# EAGLE design FlightComputer_DeploymentBoard (EAGLE 9.0.1)
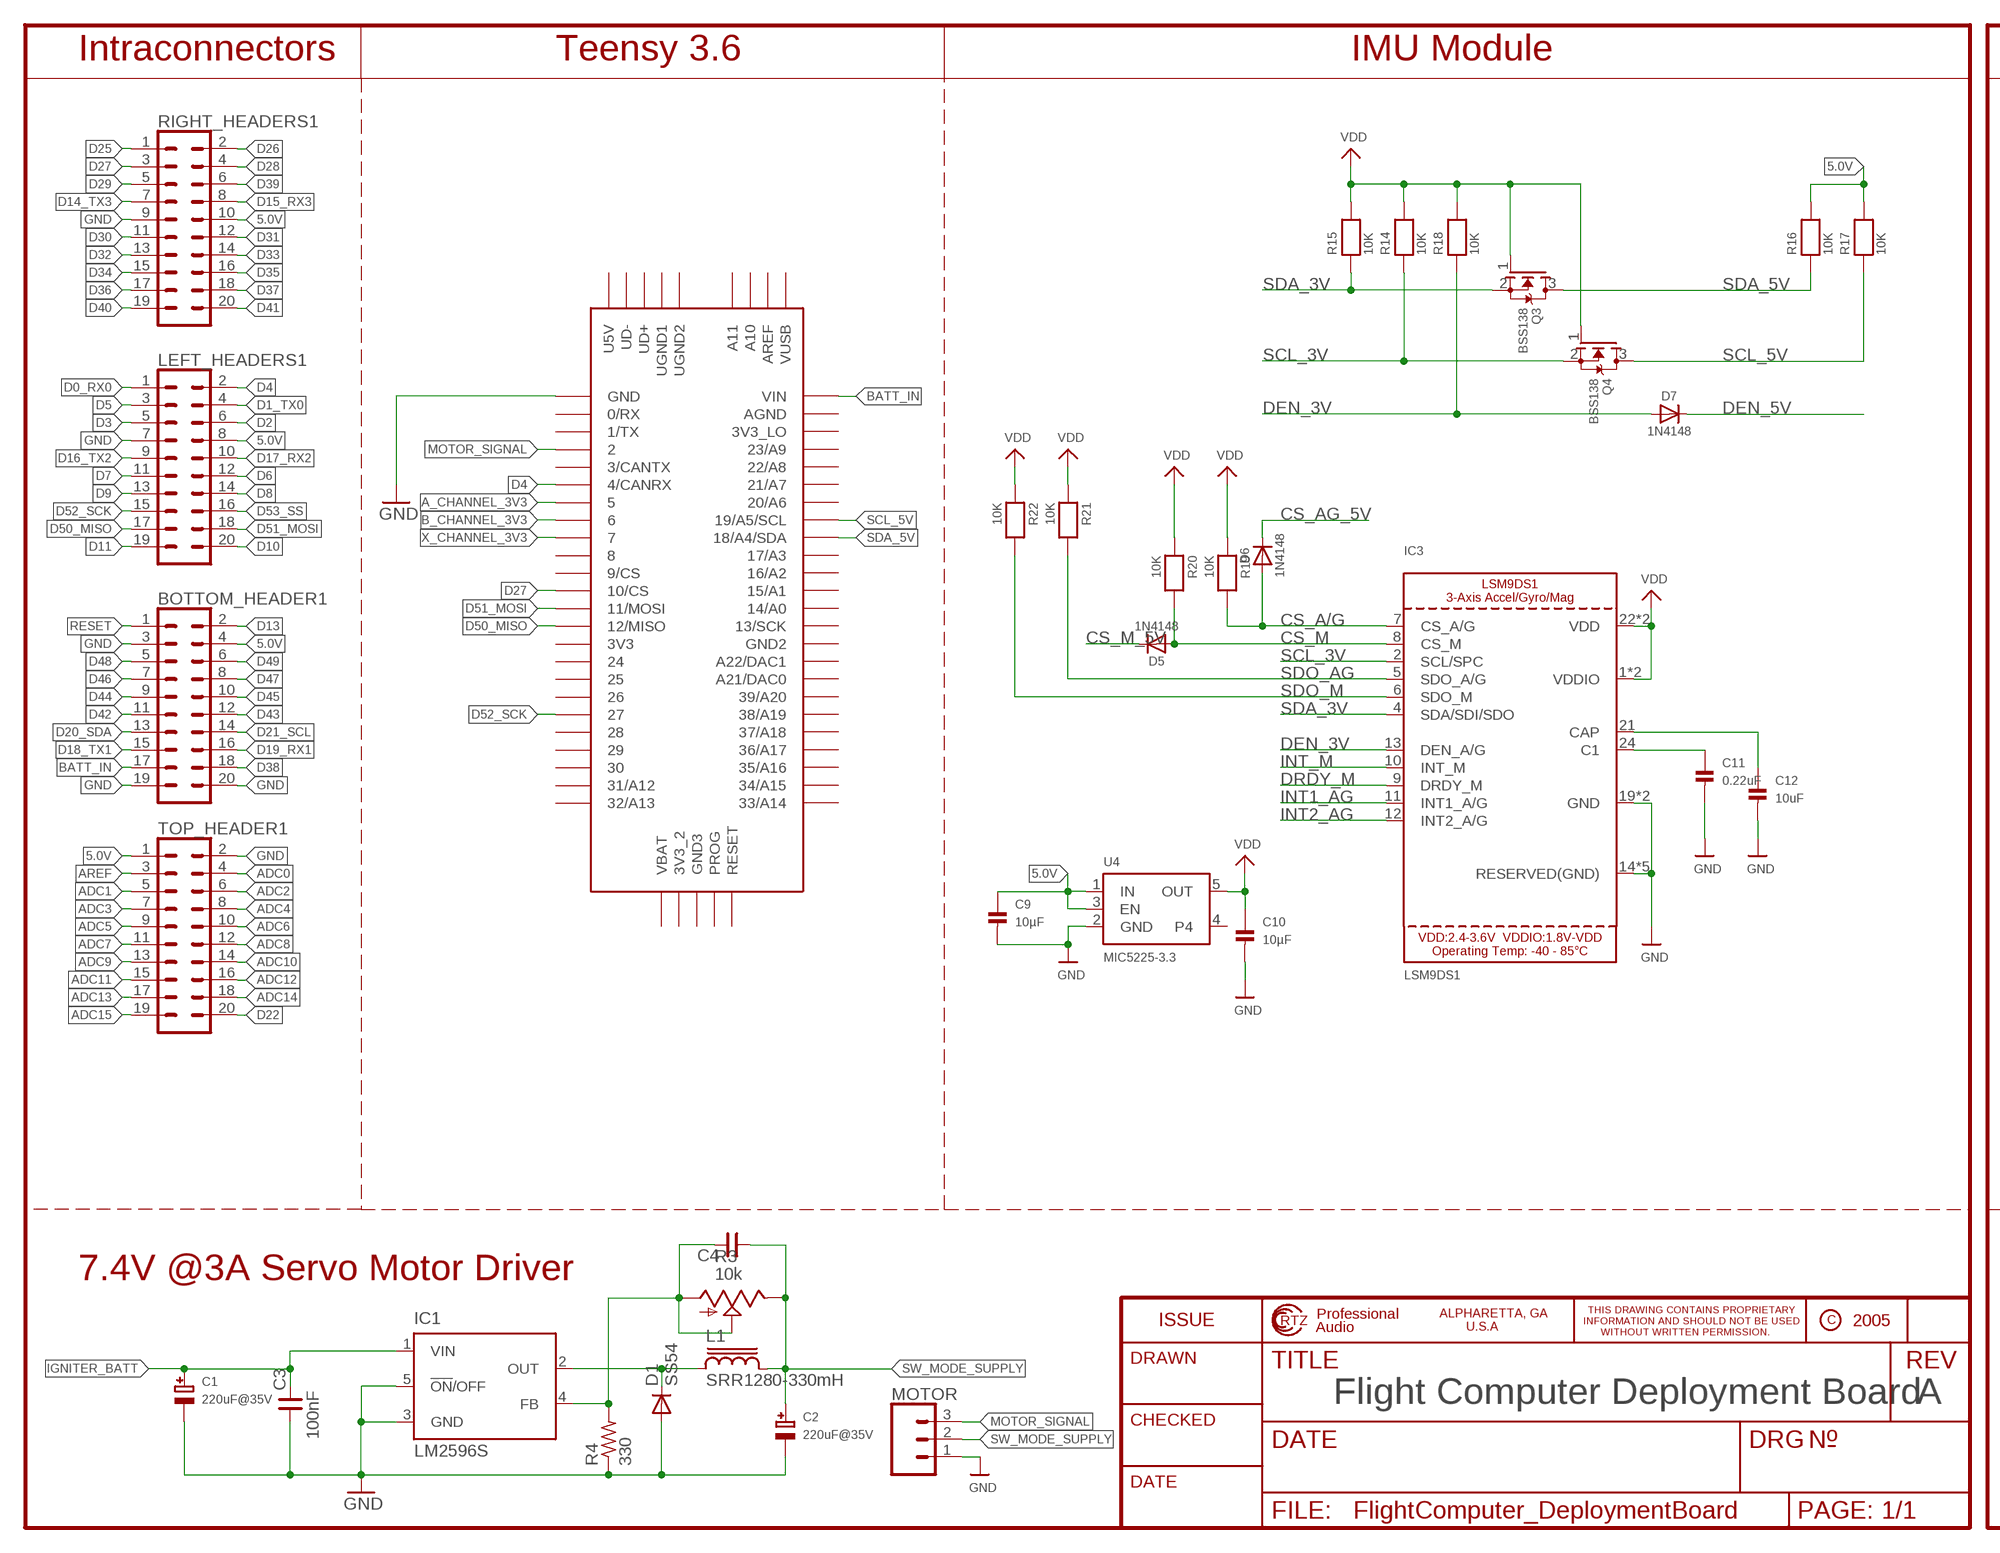
[diagram p0: schematic, sheet 1, part 1 of 2]
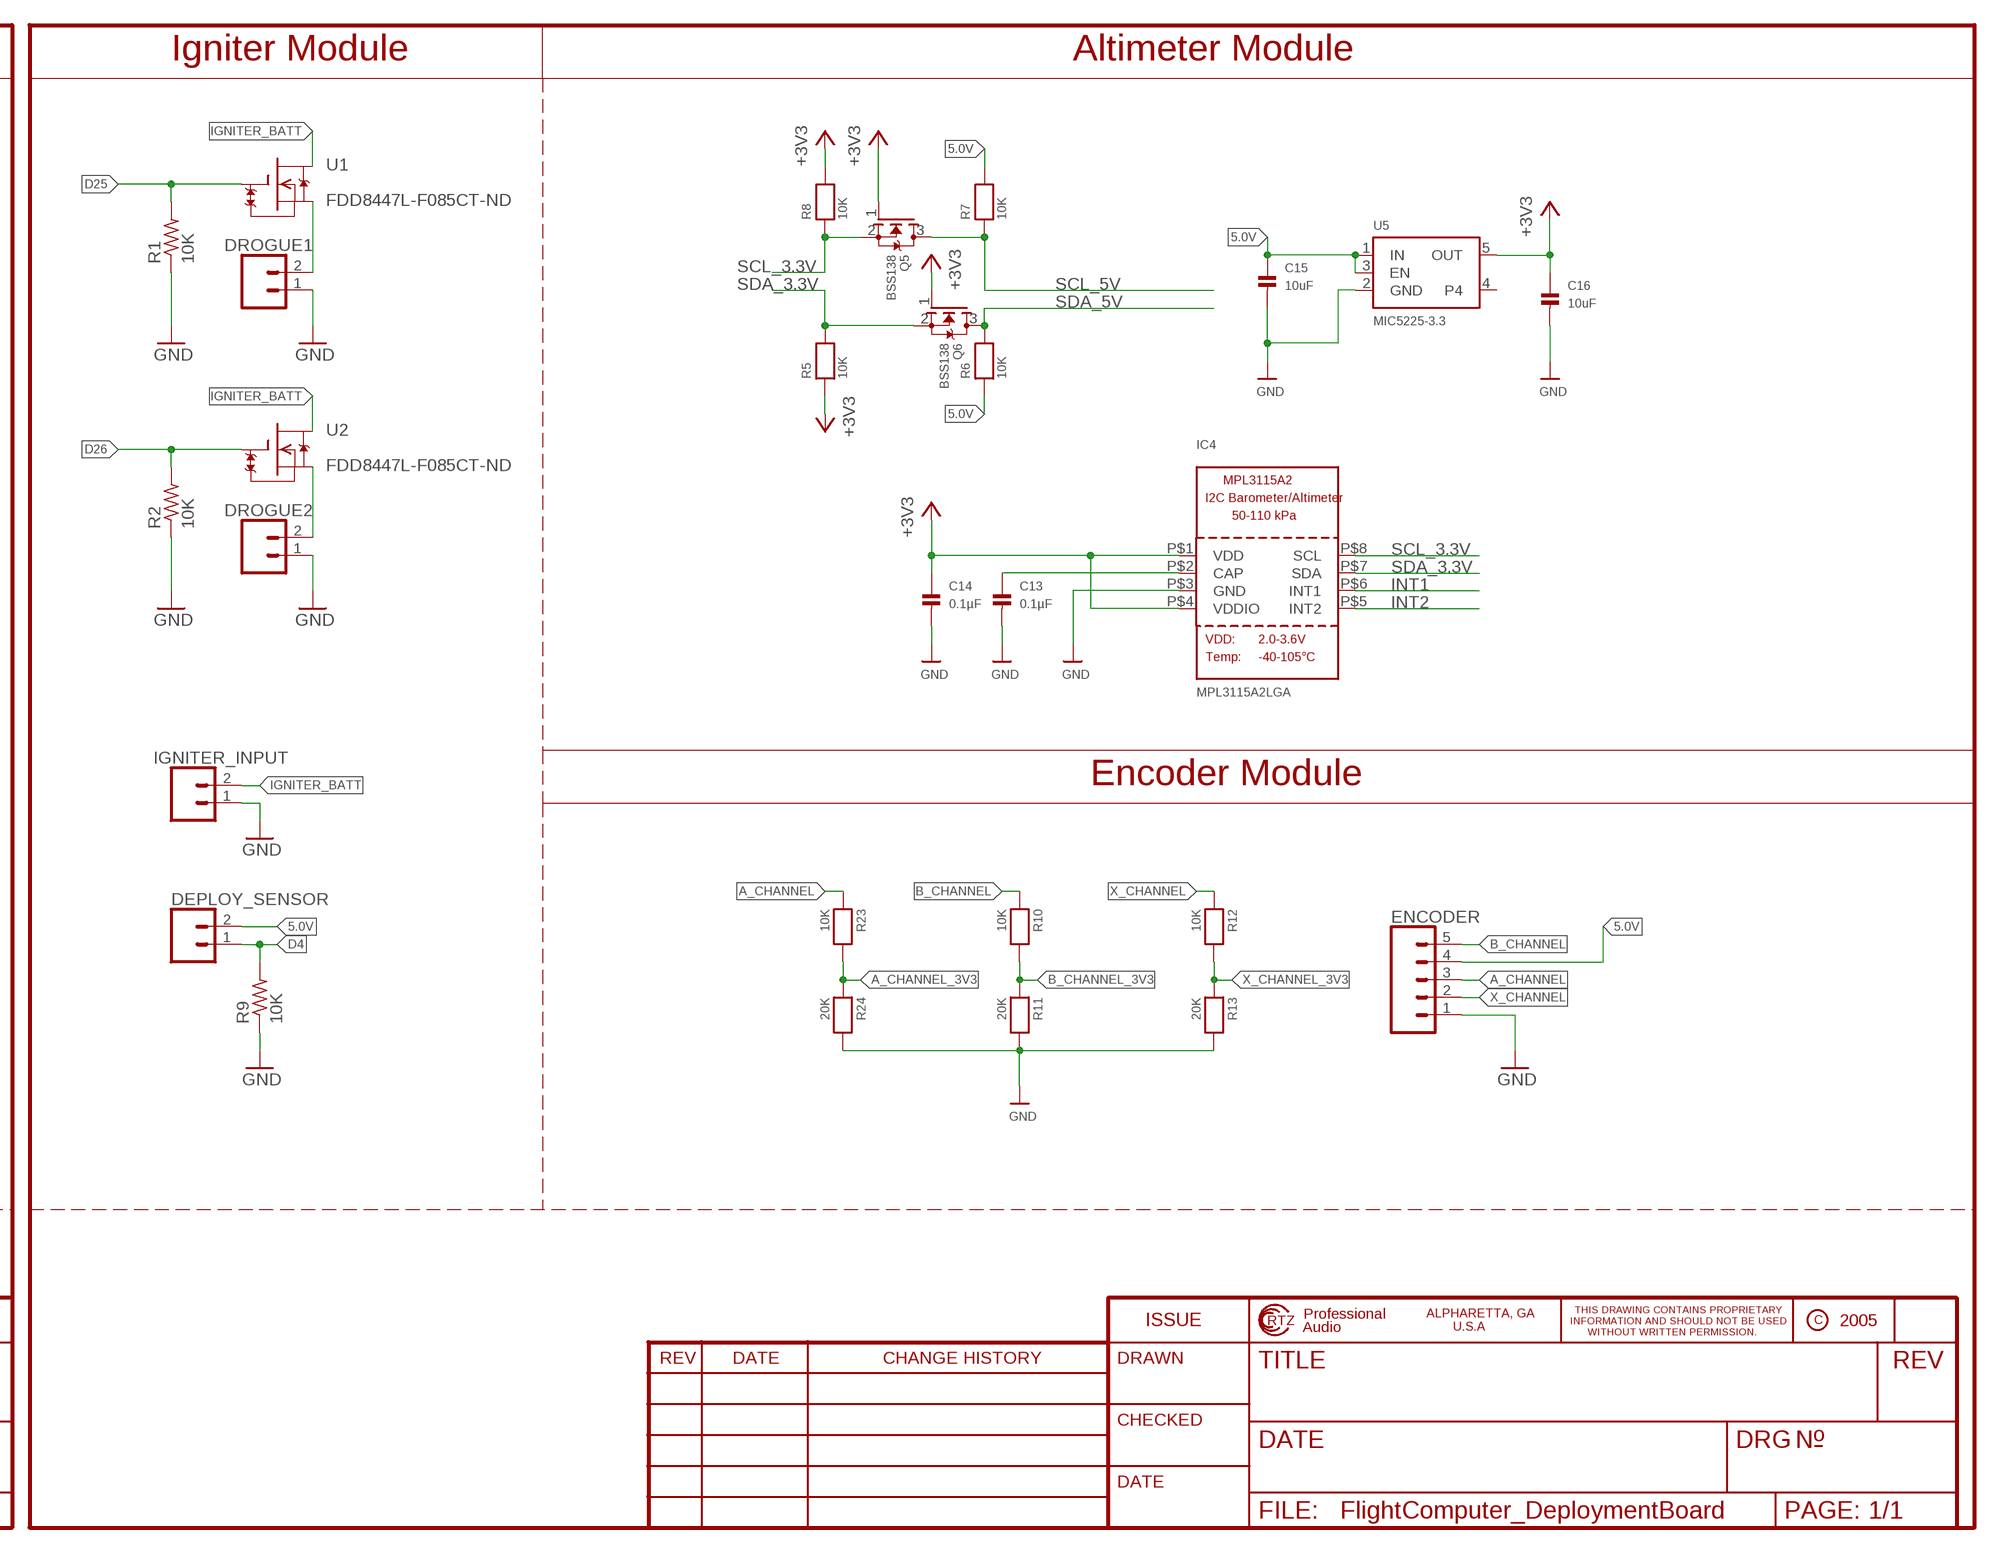
[diagram p1: schematic, sheet 1, part 2 of 2]

## Parts
BOTTOM_HEADER1  CONN_10X2  [2X10]
C1  220uF@35V  CAP_ELECTROLYTICPANASONIC_D  [PANASONIC_D]
C2  220uF@35V  CAP_ELECTROLYTICPANASONIC_D  [PANASONIC_D]
C3  100nF  CNP-0603  [0603]
C4  CNP-0603  [0603]
C9  10µF  CAP_CERAMIC0603  [0603]
C10  10µF  CAP_CERAMIC0603  [0603]
C11  0.22uF  CAP_CERAMIC0603  [0603]
C12  10uF  CAP_CERAMIC0603  [0603]
C13  0.1µF  CAP_CERAMIC0603  [0603]
C14  0.1µF  CAP_CERAMIC0603  [0603]
C15  10uF  CAP_CERAMIC0603  [0603]
C16  10uF  CAP_CERAMIC0603  [0603]
D1  SS54  S3G  [DO214AB]
D5  1N4148  DIODESOD-323  [SOD-323]
D6  1N4148  DIODESOD-323  [SOD-323]
D7  1N4148  DIODESOD-323  [SOD-323]
DEPLOY_SENSOR  CONN_023.5MM  [SCREWTERMINAL-3.5MM-2]
DROGUE1  CONN_023.5MM  [SCREWTERMINAL-3.5MM-2]
DROGUE2  CONN_023.5MM  [SCREWTERMINAL-3.5MM-2]
ENCODER  CONN_05  [1X05]
IC1  LM2596S  [TO263-5]
IC3  LSM9DS1  [LGA24_3.5X3.1MM]
IC4  MPL3115A2LGA  [LGA8]
IGNITER_INPUT  CONN_02  [1X02]
L1  SRR1280-330mH  SRR1280  [SRR1280]
LEFT_HEADERS1  CONN_10X2  [2X10]
MOTOR  CONN_03  [1X03]
Q3  BSS138  MOSFET-NWIDE  [SOT23-WIDE]
Q4  BSS138  MOSFET-NWIDE  [SOT23-WIDE]
Q5  BSS138  MOSFET-NWIDE  [SOT23-WIDE]
Q6  BSS138  MOSFET-NWIDE  [SOT23-WIDE]
R1  10K  R-US_R0805  [R0805]
R2  10K  R-US_R0805  [R0805]
R3  10k  TRIM_US-S64W  [S64W]
R4  330  R-US_R0603  [R0603]
R5  10K  RESISTOR0603  [0603]
R6  10K  RESISTOR0603  [0603]
R7  10K  RESISTOR0603  [0603]
R8  10K  RESISTOR0603  [0603]
R9  10K  R-US_R0805  [R0805]
R10  10K  RESISTOR0603  [0603]
R11  20K  RESISTOR0603  [0603]
R12  10K  RESISTOR0603  [0603]
R13  20K  RESISTOR0603  [0603]
R14  10K  RESISTOR0603  [0603]
R15  10K  RESISTOR0603  [0603]
R16  10K  RESISTOR0603  [0603]
R17  10K  RESISTOR0603  [0603]
R18  10K  RESISTOR0603  [0603]
R19  10K  RESISTOR0603  [0603]
R20  10K  RESISTOR0603  [0603]
R21  10K  RESISTOR0603  [0603]
R22  10K  RESISTOR0603  [0603]
R23  10K  RESISTOR0603  [0603]
R24  20K  RESISTOR0603  [0603]
RIGHT_HEADERS1  CONN_10X2  [2X10]
TOP_HEADER1  CONN_10X2  [2X10]
U1  FDD8447L-F085CT-ND  TSM4ND50  [TO252]
U2  FDD8447L-F085CT-ND  TSM4ND50  [TO252]
U4  MIC5225-3.3  VREG_SOT23-5  [SOT23-5]
U5  MIC5225-3.3  VREG_SOT23-5  [SOT23-5]
U$1  TEENSY_3.5/3.6  [TEENSY_3.5/3.6]

## Nets
5.0V: BOTTOM_HEADER1.4 C9.1 C15.1 DEPLOY_SENSOR.2 ENCODER.4 LEFT_HEADERS1.8 R6.1 R7.2 R16.2 R17.2 RIGHT_HEADERS1.10 TOP_HEADER1.1 U4.1(IN) U4.3(EN) U5.1(IN) U5.3(EN)
+3V3: C14.1 C16.1 IC4.P$1(VDD) IC4.P$4(VDDIO) Q5.1(G) Q6.1(G) R5.1 R8.2 U5.5(OUT)
A_CHANNEL: ENCODER.3 R23.1
A_CHANNEL_3V3: R23.2 R24.1 U$1.5
ADC0: TOP_HEADER1.4
ADC1: TOP_HEADER1.5
ADC2: TOP_HEADER1.6
ADC3: TOP_HEADER1.7
ADC4: TOP_HEADER1.8
ADC5: TOP_HEADER1.9
ADC6: TOP_HEADER1.10
ADC7: TOP_HEADER1.11
ADC8: TOP_HEADER1.12
ADC9: TOP_HEADER1.13
ADC10: TOP_HEADER1.14
ADC11: TOP_HEADER1.15
ADC12: TOP_HEADER1.16
ADC13: TOP_HEADER1.17
ADC14: TOP_HEADER1.18
ADC15: TOP_HEADER1.19
AREF: TOP_HEADER1.3
B_CHANNEL: ENCODER.5 R10.1
B_CHANNEL_3V3: R10.2 R11.1 U$1.6
BATT_IN: BOTTOM_HEADER1.17 U$1.VIN
C2: C11.1 IC3.24(C1)
CAP1: C12.1 IC3.21(CAP)
CAP2: C13.1 IC4.P$2(CAP)
CS_A/G: D6.A IC3.7(CS_A/G) R19.2
CS_AG_5V: D6.C
CS_M: D5.A IC3.8(CS_M) R20.2
CS_M_5V: D5.C
D0_RX0: LEFT_HEADERS1.1
D1_TX0: LEFT_HEADERS1.4
D2: LEFT_HEADERS1.6
D3: LEFT_HEADERS1.5
D4: DEPLOY_SENSOR.1 LEFT_HEADERS1.2 R9.2 U$1.4/CANRX
D5: LEFT_HEADERS1.3
D6: LEFT_HEADERS1.12
D7: LEFT_HEADERS1.11
D8: LEFT_HEADERS1.14
D9: LEFT_HEADERS1.13
D10: LEFT_HEADERS1.20
D11: LEFT_HEADERS1.19
D13: BOTTOM_HEADER1.2
D14_TX3: RIGHT_HEADERS1.7
D15_RX3: RIGHT_HEADERS1.8
D16_TX2: LEFT_HEADERS1.9
D17_RX2: LEFT_HEADERS1.10
D18_TX1: BOTTOM_HEADER1.15
D19_RX1: BOTTOM_HEADER1.16
D20_SDA: BOTTOM_HEADER1.13
D21_SCL: BOTTOM_HEADER1.14
D22: TOP_HEADER1.20
D25: R1.2 RIGHT_HEADERS1.1 U1.G
D26: R2.2 RIGHT_HEADERS1.2 U2.G
D27: RIGHT_HEADERS1.3 U$1.10/CS
D28: RIGHT_HEADERS1.4
D29: RIGHT_HEADERS1.5
D30: RIGHT_HEADERS1.11
D31: RIGHT_HEADERS1.12
D32: RIGHT_HEADERS1.13
D33: RIGHT_HEADERS1.14
D34: RIGHT_HEADERS1.15
D35: RIGHT_HEADERS1.16
D36: RIGHT_HEADERS1.17
D37: RIGHT_HEADERS1.18
D38: BOTTOM_HEADER1.18
D39: RIGHT_HEADERS1.6
D40: RIGHT_HEADERS1.19
D41: RIGHT_HEADERS1.20
D42: BOTTOM_HEADER1.11
D43: BOTTOM_HEADER1.12
D44: BOTTOM_HEADER1.9
D45: BOTTOM_HEADER1.10
D46: BOTTOM_HEADER1.7
D47: BOTTOM_HEADER1.8
D48: BOTTOM_HEADER1.5
D49: BOTTOM_HEADER1.6
D50_MISO: LEFT_HEADERS1.17 U$1.12/MISO
D51_MOSI: LEFT_HEADERS1.18 U$1.11/MOSI
D52_SCK: LEFT_HEADERS1.15 U$1.27
D53_SS: LEFT_HEADERS1.16
DEN_3V: D7.A IC3.13(DEN_A/G) R18.1
DEN_5V: D7.C
DRDY_M: IC3.9(DRDY_M)
GND: BOTTOM_HEADER1.3 BOTTOM_HEADER1.19 BOTTOM_HEADER1.20 C1.- C2.- C3.1 C9.2 C10.2 C11.2 C12.2 C13.2 C14.2 C15.2 C16.2 D1.A DROGUE1.1 DROGUE2.1 ENCODER.1 IC1.3(GND) IC1.5(!ON!/OFF) IC3.14(RESERVED(GND)) IC3.15(RESERVED(GND)) IC3.16(RESERVED(GND)) IC3.17(RESERVED(GND)) IC3.18(RESERVED(GND)) IC3.19(GND) IC3.20(GND) IC4.P$3(GND) IGNITER_INPUT.1 LEFT_HEADERS1.7 MOTOR.1 R1.1 R2.1 R4.1 R9.1 R11.2 R13.2 R24.2 RIGHT_HEADERS1.9 TOP_HEADER1.2 U4.2(GND) U5.2(GND) U$1.GND
IGNITER_BATT: C1.+ C3.2 IC1.1(VIN) IGNITER_INPUT.2 U1.D U2.D
INT1: IC4.P$6(INT1)
INT1_AG: IC3.11(INT1_A/G)
INT2: IC4.P$5(INT2)
INT2_AG: IC3.12(INT2_A/G)
INT_M: IC3.10(INT_M)
MOTOR_SIGNAL: MOTOR.3 U$1.2
N$3: D1.C IC1.2(OUT) L1.1
N$4: C4.2 IC1.4(FB) R3.A R3.S R4.2
RESET: BOTTOM_HEADER1.1
SCL_3.3V: IC4.P$8(SCL) Q5.2(S) R8.1
SCL_3V: IC3.2(SCL/SPC) Q4.2(S) R14.1
SCL_5V: Q4.3(D) Q5.3(D) R7.1 R17.1 U$1.19/A5/SCL
SDA_3.3V: IC4.P$7(SDA) Q6.2(S) R5.2
SDA_3V: IC3.4(SDA/SDI/SDO) Q3.2(S) R15.1
SDA_5V: Q3.3(D) Q6.3(D) R6.2 R16.1 U$1.18/A4/SDA
SDO_AG: IC3.5(SDO_A/G) R21.2
SDO_M: IC3.6(SDO_M) R22.2
SOURCE: DROGUE1.2 U1.S
SOURCE1: DROGUE2.2 U2.S
SW_MODE_SUPPLY: C2.+ C4.1 L1.2 MOTOR.2 R3.E
VDD: C10.1 IC3.1(VDDIO) IC3.3(VDDIO) IC3.22(VDD) IC3.23(VDD) Q3.1(G) Q4.1(G) R14.2 R15.2 R18.2 R19.1 R20.1 R21.1 R22.1 U4.5(OUT)
X_CHANNEL: ENCODER.2 R12.1
X_CHANNEL_3V3: R12.2 R13.1 U$1.7
Unconnected: U4.4 U5.4 U$1.0/RX U$1.1/TX U$1.3/CANTX U$1.3V3 U$1.3V3_2 U$1.3V3_LO U$1.8 U$1.9/CS U$1.13/SCK U$1.14/A0 U$1.15/A1 U$1.16/A2 U$1.17/A3 U$1.20/A6 U$1.21/A7 U$1.21/DAC0(A21/DAC0) U$1.22/A8 U$1.23/A9 U$1.24 U$1.25 U$1.26 U$1.28 U$1.29 U$1.30 U$1.31/A12 U$1.32/A13 U$1.33/A14 U$1.34/A15 U$1.35/A16 U$1.36/A17 U$1.37/A18 U$1.38/A19 U$1.39/A20 U$1.A10 U$1.A11 U$1.A22/DAC1 U$1.AGND U$1.AREF U$1.GND2 U$1.GND3 U$1.PROG U$1.RESET U$1.U5V U$1.UD+ U$1.UD- U$1.UGND1 U$1.UGND2 U$1.VBAT U$1.VUSB

## Notes on the sheet
- Intraconnectors | Teensy 3.6 | IMU Module | Igniter Module | Altimeter Module
- Encoder Module
- 7.4V @3A Servo Motor Driver
- Flight Computer Deployment Board | A

## Library data of the parts
BOTTOM_HEADER1 LEFT_HEADERS1 RIGHT_HEADERS1 TOP_HEADER1 = SparkFun-Connectors:CONN_10X2: Multi connection point. Often used as Generic Header-pin footprint for 0.1 inch spaced/style header connections On any of the 0.1 inch spaced packages, you can populate with these: Break Away Headers - Straight <https://www.sparkfun.com/products/116> (PRT-00116) Break Away Male Headers - Right Angle <https://www.sparkfun.com/products/553> (PRT-00553) Female Headers <https://www.sparkfun.com/products/115> (PRT-00115) Break Away Headers - Machine Pin <https://www.sparkfun.com/products/117> (PRT-00117) Break Away Female Headers - Swiss Machine Pin <https://www.sparkfun.com/products/743> (PRT-00743) Special note about the "SPECIAL" package: This was SPECIALLY designed to be used with our Graphic LCD Backpack. Be sure you want to use this! It is not only staggered on each line of header holes, but IT IS ALSO offset of the center point of the top and bottom lines by 5 mil. This causes the headers to lock into place on the "standard" footprint on the LCD screen. The extra squares on the tdocu layer are there simply to reference other pins (if you were to actually populate a longer header than ten long - this is what we do with the backpacks).
C1 C2 = microbuilder:CAP_ELECTROLYTIC: Electrolytic Capacitors PANASONIC_C - Size C Panasonic Electrolytic Aluminum Capacitor 47µF 16V 20% Electrolytic Capacitor [Digikey: PCE3890TR-ND] PANASONIC_D - Size D Panasonic Electrolytic Aluminum Capacitor 100µF 25V 20% Electrolytic Capacitor [Digikey: PCE3898TR-ND]
C3 C4 = cap-master:CNP-: NON-POLARIZED CAP
C9-C16 = microbuilder:CAP_CERAMIC: Ceramic Capacitors 0402 - 0402 Surface Mount Capacitors 16pF 50V 5% [Digikey: 445-4899-2-ND] 18pF 50V 5% [Digikey: 490-1281-2-ND] 22pF 50V 5% [Digikey: 490-1283-2-ND] 68pF 50V 5% [Digikey: 490-1289-2-ND] 0.1uF 10V 10% [Digikey: 490-1318-2-ND] 1.0uF 6.3V 10% [Digikey: 490-1320-2-ND] 0603 - 0603 Surface Mount Capacitors 16 pF 50V 5% [Digikey: 445-5051-2-ND] 22 pF 50V [Digikey: PCC220ACVTR-ND] 33 pF 50V 5% [Digikey: 490-1415-1-ND] 56pF 50V 5% [Digikey: 490-1421-1-ND] 220pF 50V 5% [Digikey: 445-1285-1-ND] 680 pF 50V 2200 pF 50V 5% C0G [Digikey: 445-1297-1-ND] 5600 pF 100V 5% X7R [Digikey: 478-3711-1-ND] 0.1 µF 25V 10% [Digikey: PCC2277TR-ND] 0.22 µF 16V 10% X7R [Digikey: 445-1318-1-ND] 1.0 µF 25V 10% [Digikey: 445-5146-2-ND] 0603 - RF Specific 3pF 250V +/-0.1pF RF [Digikey: 712-1347-1-ND] 18 pF 250V 5% [Digikey: 478-3505-1-ND or 712-1322-1-ND] 56 pF 250V 5% C0G RF [Digikey: 490-4867-1-ND] 68 pF 250V RF [Digikey: 490-4868-1-ND] 0805 - 0805 Surface Mount Capacitors 220 pF 250V 2% RF Ceramic Capacitor [Digikey: 712-1398-1-ND] 1000 pF 50V 2% NP0 Ceramic Capacitor [Digikey: 478-3760-1-ND] 0.1 µF 25V 10% Ceramic Capacitor [Digikey: PCC1828TR-ND] 1.0 µF 16V 10% Ceramic Capacitor[Digikey: 490-1691-2-ND] 10.0 µF 10V 10% Ceramic Capacitor[Digikey: 709-1228-1-ND] 10.0 uF 16V 10% Ceramic Capacitor [Digikey: 478-5165-2-ND] 47 uF 6.3V 20% Ceramic Capacitor [Digikey: 587-1779-1-ND or 399-5506-1-ND] 1206 - 1206 Surface Mount Capacitors 47uF 10V 20% Ceramic Capacitor [Digikey: 490-5528-1-ND or 399-5508-1-ND or 445-6010-1-ND]
D1 = s3x_10:S3*: S3A - S3N General Purpose Rectifiers Source: http://www.fairchildsemi.com/datasheets/S3/S3A.pdf; MF: Fairchild; MPN: S3G; OC_FARNELL: 2454094; OC_NEWARK: 58K2397
D5-D7 = microbuilder:DIODE: Diode SMA Model Volts Amps Type Vf Ir Digikey # Notes SSA34-E3 40V 3A Schottky 480mV @ 3A 200uA @ 40V SSA34-E3/61TGITR-ND CDBA120-G 20V 1A Schottky 500mV @ 1A 500uA @ 20V 641-1014-6-ND REEL MBRA210 10V 2A Schottky 350mV @ 2A 700uA @ 10V MBRA210LT3 SOD-123 Model Volts Amps Type Vf Ir Order # Notes BAT54T1G 30V 200mA Schottky 800mV @ 200mA 2uA @ 25V BAT54T1GOSTR-ND B0530W 30V 500mA Schottky 430mV @ 500mA 130uA @ 30V B0530W-FDICT-ND REEL MBR120 20V 1A Schottky 340mV @ 1A MBR120VLSFT1GOSCT-ND SOD-323 Model Volts Amps Type Vf Ir Order # Notes PMEG2005EJ 20V 500mA Schottky 355mV @ 500mA 568-4110-1-ND ZLLS410 10V 570mA Schottky 380mV @ 570mA ZLLS410CT-ND 1N4148WS 75V 150mA Silicon/Simple 1V 1N4148WSFSCT-ND REEL SOD-523 Model Volts Amps Type Vf Ir Order # Notes BAT54XV2 30V 200mA Schottky 0.8V @ 100mA BAT54XV2CT-ND TB751S 30V 30mA Schottky RB751S-40TE61CT-ND SOT23-R/W (R = Solder Paste/Reflow Ovens, W = Hand-Soldering) Model Volts Amps Type Vf Ir Order # Notes BAT54FILM 40V 300mA Schottky 497-7162-1-ND POWERDI-5 Model Volts Amps Type Vf Ir Order # Notes PDS560 60V 5A Schottky 670mV @ 5A 150uA @ 60V PDS560DICT-ND
DEPLOY_SENSOR DROGUE1 DROGUE2 = SparkFun-Connectors:CONN_02: Multi connection point. Often used as Generic Header-pin footprint for 0.1 inch spaced/style header connections On any of the 0.1 inch spaced packages, you can populate with these: Break Away Headers - Straight <https://www.sparkfun.com/products/116> (PRT-00116) Break Away Male Headers - Right Angle <https://www.sparkfun.com/products/553> (PRT-00553) Female Headers <https://www.sparkfun.com/products/115> (PRT-00115) Break Away Headers - Machine Pin <https://www.sparkfun.com/products/117> (PRT-00117) Break Away Female Headers - Swiss Machine Pin <https://www.sparkfun.com/products/743> (PRT-00743) For SCREWTERMINALS and SPRING TERMINALS visit here: Screw Terimnals on SparkFun.com <https://www.sparkfun.com/search/results?term=Screw+Terminals> (5mm/3.5mm/2.54mm spacing) This device is also useful as a general connection point to wire up your design to another part of your project. Our various solder wires solder well into these plated through hole pads. Hook-Up Wire - Assortment (Stranded, 22 AWG) <https://www.sparkfun.com/products/11375> (PRT-11375) Hook-Up Wire - Assortment (Solid Core, 22 AWG) <https://www.sparkfun.com/products/11367> (PRT-11367) View the entire wire category on our website here <https://www.sparkfun.com/categories/141> Special notes: Molex polarized connector foot print use with: PRT-08233 with associated crimp pins and housings. 2.54_SCREWTERM for use with PRT-10571. 3.5mm Screw Terminal footprints for PRT-08084 5mm Screw Terminal footprints for use with PRT-08432; PROD_ID: CONN-08399
ENCODER = SparkFun-Connectors:CONN_05: Multi connection point. Often used as Generic Header-pin footprint for 0.1 inch spaced/style header connections On any of the 0.1 inch spaced packages, you can populate with these: Break Away Headers - Straight <https://www.sparkfun.com/products/116> (PRT-00116) Break Away Male Headers - Right Angle <https://www.sparkfun.com/products/553> (PRT-00553) Female Headers <https://www.sparkfun.com/products/115> (PRT-00115) Break Away Headers - Machine Pin <https://www.sparkfun.com/products/117> (PRT-00117) Break Away Female Headers - Swiss Machine Pin <https://www.sparkfun.com/products/743> (PRT-00743) For SCREWTERMINALS and SPRING TERMINALS visit here: Screw Terimnals on SparkFun.com <https://www.sparkfun.com/search/results?term=Screw+Terminals> (5mm/3.5mm/2.54mm spacing) This device is also useful as a general connection point to wire up your design to another part of your project. Our various solder wires solder well into these plated through hole pads. Hook-Up Wire - Assortment (Stranded, 22 AWG) <https://www.sparkfun.com/products/11375> (PRT-11375) Hook-Up Wire - Assortment (Solid Core, 22 AWG) <https://www.sparkfun.com/products/11367> (PRT-11367) View the entire wire category on our website here <https://www.sparkfun.com/categories/141> Special notes: Molex polarized connector foot print use with SKU : PRT-08231 with associated crimp pins and housings. 1MM SMD Version SKU: PRT-10208
IC1 = national-semiconductor:LM2596: SIMPLE SWITCHER® Power Converter 150 kHz 3A Step-Down Voltage Regulator Source: http://www.national.com/ds/LM/LM2596.pdf; MF: NATIONAL SEMICONDUCTOR; MPN: LM2596S-ADJ/NOPB; OC_FARNELL: 9494367; OC_NEWARK: 41K3842
IC3 = microbuilder:LSM9DS1
IC4 = microbuilder:MPL3115A2
IGNITER_INPUT = SparkFun-Connectors:CONN_02: Multi connection point. Often used as Generic Header-pin footprint for 0.1 inch spaced/style header connections On any of the 0.1 inch spaced packages, you can populate with these: Break Away Headers - Straight <https://www.sparkfun.com/products/116> (PRT-00116) Break Away Male Headers - Right Angle <https://www.sparkfun.com/products/553> (PRT-00553) Female Headers <https://www.sparkfun.com/products/115> (PRT-00115) Break Away Headers - Machine Pin <https://www.sparkfun.com/products/117> (PRT-00117) Break Away Female Headers - Swiss Machine Pin <https://www.sparkfun.com/products/743> (PRT-00743) For SCREWTERMINALS and SPRING TERMINALS visit here: Screw Terimnals on SparkFun.com <https://www.sparkfun.com/search/results?term=Screw+Terminals> (5mm/3.5mm/2.54mm spacing) This device is also useful as a general connection point to wire up your design to another part of your project. Our various solder wires solder well into these plated through hole pads. Hook-Up Wire - Assortment (Stranded, 22 AWG) <https://www.sparkfun.com/products/11375> (PRT-11375) Hook-Up Wire - Assortment (Solid Core, 22 AWG) <https://www.sparkfun.com/products/11367> (PRT-11367) View the entire wire category on our website here <https://www.sparkfun.com/categories/141> Special notes: Molex polarized connector foot print use with: PRT-08233 with associated crimp pins and housings. 2.54_SCREWTERM for use with PRT-10571. 3.5mm Screw Terminal footprints for PRT-08084 5mm Screw Terminal footprints for use with PRT-08432
L1 = inductor-bourns:SRR1280: POWER INDUCTOR
MOTOR = SparkFun-Connectors:CONN_03: Multi connection point. Often used as Generic Header-pin footprint for 0.1 inch spaced/style header connections On any of the 0.1 inch spaced packages, you can populate with these: Break Away Headers - Straight <https://www.sparkfun.com/products/116> (PRT-00116) Break Away Male Headers - Right Angle <https://www.sparkfun.com/products/553> (PRT-00553) Female Headers <https://www.sparkfun.com/products/115> (PRT-00115) Break Away Headers - Machine Pin <https://www.sparkfun.com/products/117> (PRT-00117) Break Away Female Headers - Swiss Machine Pin <https://www.sparkfun.com/products/743> (PRT-00743) Stackable Header - 3 Pin (Female, 0.1") <https://www.sparkfun.com/products/13875> (PRT-13875) For SCREWTERMINALS and SPRING TERMINALS visit here: Screw Terimnals on SparkFun.com <https://www.sparkfun.com/search/results?term=Screw+Terminals> (5mm/3.5mm/2.54mm spacing) This device is also useful as a general connection point to wire up your design to another part of your project. Our various solder wires solder well into these plated through hole pads. Hook-Up Wire - Assortment (Stranded, 22 AWG) <https://www.sparkfun.com/products/11375> (PRT-11375) Hook-Up Wire - Assortment (Solid Core, 22 AWG) <https://www.sparkfun.com/products/11367> (PRT-11367) View the entire wire category on our website here <https://www.sparkfun.com/categories/141> Special notes: Molex polarized connector foot print use with SKU : PRT-08232 with associated crimp pins and housings.
Q3-Q6 = microbuilder:MOSFET-N: N-Channel Mosfet LEGEND VDS: Voltage Drain-Source ID: Drain Current RDS(ON): Drain-Source On-State Resistance VGS(TH): Gate-Source Threshold Voltage CISS: Drain-Source Input Capacitance SOT-23 Name VDS ID RDS(ON) VGS(TH) CISS Order Number 2N7002E 60V 260mA 2.5 Ohm 2.5V @ 250uA 26.7pF @ 25V 2N7002ET1GOSTR-ND BSH103 30V 850mA 400 mOhm 400mV @ 1mA 83pF @ 24V BSH103,235-ND BSS138 60V 320mA 1.6 Ohm 1.5V @ 250uA 50pF @ 10V Mouser: 771-BSS138PW115 DMN2075U-7 20V 4.2A 38 mOhm 1V @ 250 uA 594.3pF @ 10V DMN2075U-7DICT-ND * BSS138 good choice for I2C level-shifting POWERPAK 1212-8 Name VDS ID RDS(ON) VGS(TH) CISS Order Number Si7308DN 60V 6A 58 mOhm 3V @ 250uA 665pF @ 15V SI7308DN-T1-E3CT-ND
R1 R2 R4 R9 = adafruit:R-US_: RESISTOR, American symbol
R3 = pot:TRIM_US-: POTENTIOMETER
R5-R8 R10-R24 = microbuilder:RESISTOR: Resistors 0402 - 0402 Surface Mount Package 22 Ohm 1% 1/16W [Digikey: 311-22.0LRTR-ND] 33 Ohm 5% 1/16W 1.0K 5% 1/16W 1.5K 5% 1/16W 2.0K 1% 1/16W 10.0K 1% 1/16W [Digikey: 311-10.0KLRTR-ND] 10.0K 5% 1/16W [Digikey: RMCF0402JT10K0TR-ND] 12.1K 1% 1/16W [Digikey: 311-22.0LRTR-ND] 100.0K 5% 1/16W 0603 - 0603 Surface Mount Package 0 Ohm 1/10 Watt 1% Resistor 15 Ohm 1/10 Watt 1% Resistor 33 Ohm 1/10 Watt 1% Resistor 49.9 Ohm 1/10 Watt 1% Resistor 100 Ohm 1/10 Watt 1% Resistor 150 Ohm 1/10 Watt 1% Resistor 240 Ohm 1/10 Watt 1% Resistor 390 Ohm 1/10 Watt 1% Resistor 560 Ohm 1/10 Watt 1% Resistor 680 Ohm 1/10 Watt 1% Resistor 750 Ohm 1/10 Watt 1% Resistor 1.0K Ohm 1/10 Watt 1% Resistor 1.5K Ohm 1/10 Watt 1% Resistor 2.0K Ohm 1/10 Watt 1% Resistor 2.2K Ohm 1/10 Watt 1% Resistor 3.3K Ohm 1/10 Watt 1% Resistor 4.7K Ohm 1/10 Watt 1% Resistor 10.0K Ohm 1/10 Watt 1% Resistor 12.0K Ohm 1/10 Watt 1% Resistor 12.1K Ohm 1/10 Watt 1% Resistor 20.0K Ohm 1/10 Watt 1% Resistor 33.0K Ohm 1/10 Watt 1% Resistor 100.0K Ohm 1/10 Watt 1% Resistor 0805 - 0805 Surface Mount Package 0 Ohm 1/8 Watt 1% Resistor 33 Ohm 1/8 Watt 1% Resistor 100 Ohm 1/8 Watt 1% Resistor 150 Ohm 1/8 Watt 1% Resistor 200 Ohm 1/8 Watt 1% Resistor 240 Ohm 1/8 Watt 1% Resistor 330 Ohm 1/8 Watt 1% Resistor 390 Ohm 1/8 Watt 1% Resistor 470 Ohm 1/8 Watt 1% Resistor 1.0K Ohm 1/8 Watt 1% Resistor 1.5K Ohm 1/8 Watt 1% Resistor 2.0K Ohm 1/8 Watt 1% Resistor 4.7K Ohm 1/8 Watt 1% Resistor 5.1K Ohm 1/8 Watt 1% Resistor 5.6K Ohm 1/8 Watt 1% Resistor 10.0K Ohm 1/8 Watt 1% Resistor 22.0K Ohm 1/8 Watt 1% Resistor 33.0K Ohm 1/8 Watt 1% Resistor 100K Ohm 1/8 Watt 1% Resistor 1206 - 1206 Surface Mount Package 2012 - 2010 Surface Mount Package 0.11 Ohm 1/2 Watt 1% Resistor - Digikey: RHM.11UCT-ND
U1 U2 = TSM4ND50:TSM4ND50: MOSFET,N CH,500V,3A,TO252 Transistor Polarity: N Channel Continuous Drain Current Id: 3A Drain Source Voltage Vds: 500V On Resistance Rds(on): 2.3ohm Rds(on) Test Voltage Vgs: 10V Power Dissipation Pd: 45W Operating Temperature Range: -55°C to +150°C Transistor Case Style: TO-252 No. of Pins: 3 SVHC: No SVHC (18-Jun-2012) Power Dissipation Pd: 45W Voltage Vgs Max: 30V
U4 U5 = microbuilder:VREG_SOT23-5: SOT23-5 Fixed Voltage Regulators Part Current Out V Out V In V Dropout θJA (°C/W) TJ (°C) Digikey Part No. ADP121 150mA 3.3V 3.4-5.5V 0.09V @ 150mA -- -- ADP121-AUJZ33R7CT-ND ADP121 150mA 3.0V 3.1-5.5V 0.09V @ 150mA -- -- ADP121-AUJZ30R7CT-ND ADP122 300mA 3.3V 3.4-5.5V 0.085V @ 300mA -- -- ADP122AUJZ-3.3-R7CT-ND ADP1712 300mA 3.3V 3.5-5.5V 0.17V @ 300mA -- -- ADP1712AUJZ-3.3-R7TR-ND AP7311 (Low Cost) 150mA 3.3V 3.5-6V 0.15V @ 150mA -- -- AP7311-33WG-7DICT-ND LD39015M18R 150mA 1.8V 1.9V-5.5V 0.08V @ 100mA -- -- 497-6977-1-ND LP2985A-33DBVR 150mA 3.3V 3.3-16V 0.28V @ 150mA 206 150 296-18479-1-ND MCP1824T-3302E/OT 300mA 3.3V 3.5V-6V 0.2V @ 300mA -- -- MCP1824T-3302E/OTCT-ND MIC5205-2.5YM5 TR 150mA 2.5V 2.7-16V 0.165V @ 150mA -- -- 576-1257-2-ND MIC5205-3.0YM5 TR 150mA 3.0V 3.2V-16V 0.165V @ 150mA -- -- 576-1258-2-ND MIC5205-3.3YM5 TR 150mA 3.3V 3.5V-16V 0.165V @ 150mA -- -- 576-1259-2-ND TPS780330220 150mA 3.3V+2.2V 3.6-5.5V 250mV Max -- -- 296-23332-1-ND TDA3663/N1,135 100mA 3.3V 3.5-45V 0.18V @ 50mA -- -- 568-5343-1-ND Max operating temp can be calculated using θJA, TJ (max junction temperature), and power in watts. Set the "Maximum Ambient Temperature" until it reaches TJ ("Max Junction Temperature"), which is the absolute limit for safe use of the regulator: Heat Sink Temperature Calculator <http://www.daycounter.com/Calculators/Heat-Sink-Temperature-Calculator.phtml> For example, With 12V source into a 3.3V LP2985 and a 30mA load, we are dissipating (12V-3.3V) * 0.03A = 0.261W. With a θJA of 206 °C/W, a TJ of 150°C, and 261mW we can safely use the chip without a heat sink up to 75°C (=147.1°C Junction Temperature).
U$1 = Teensy356:TEENSY_3.5/3.6

## Board
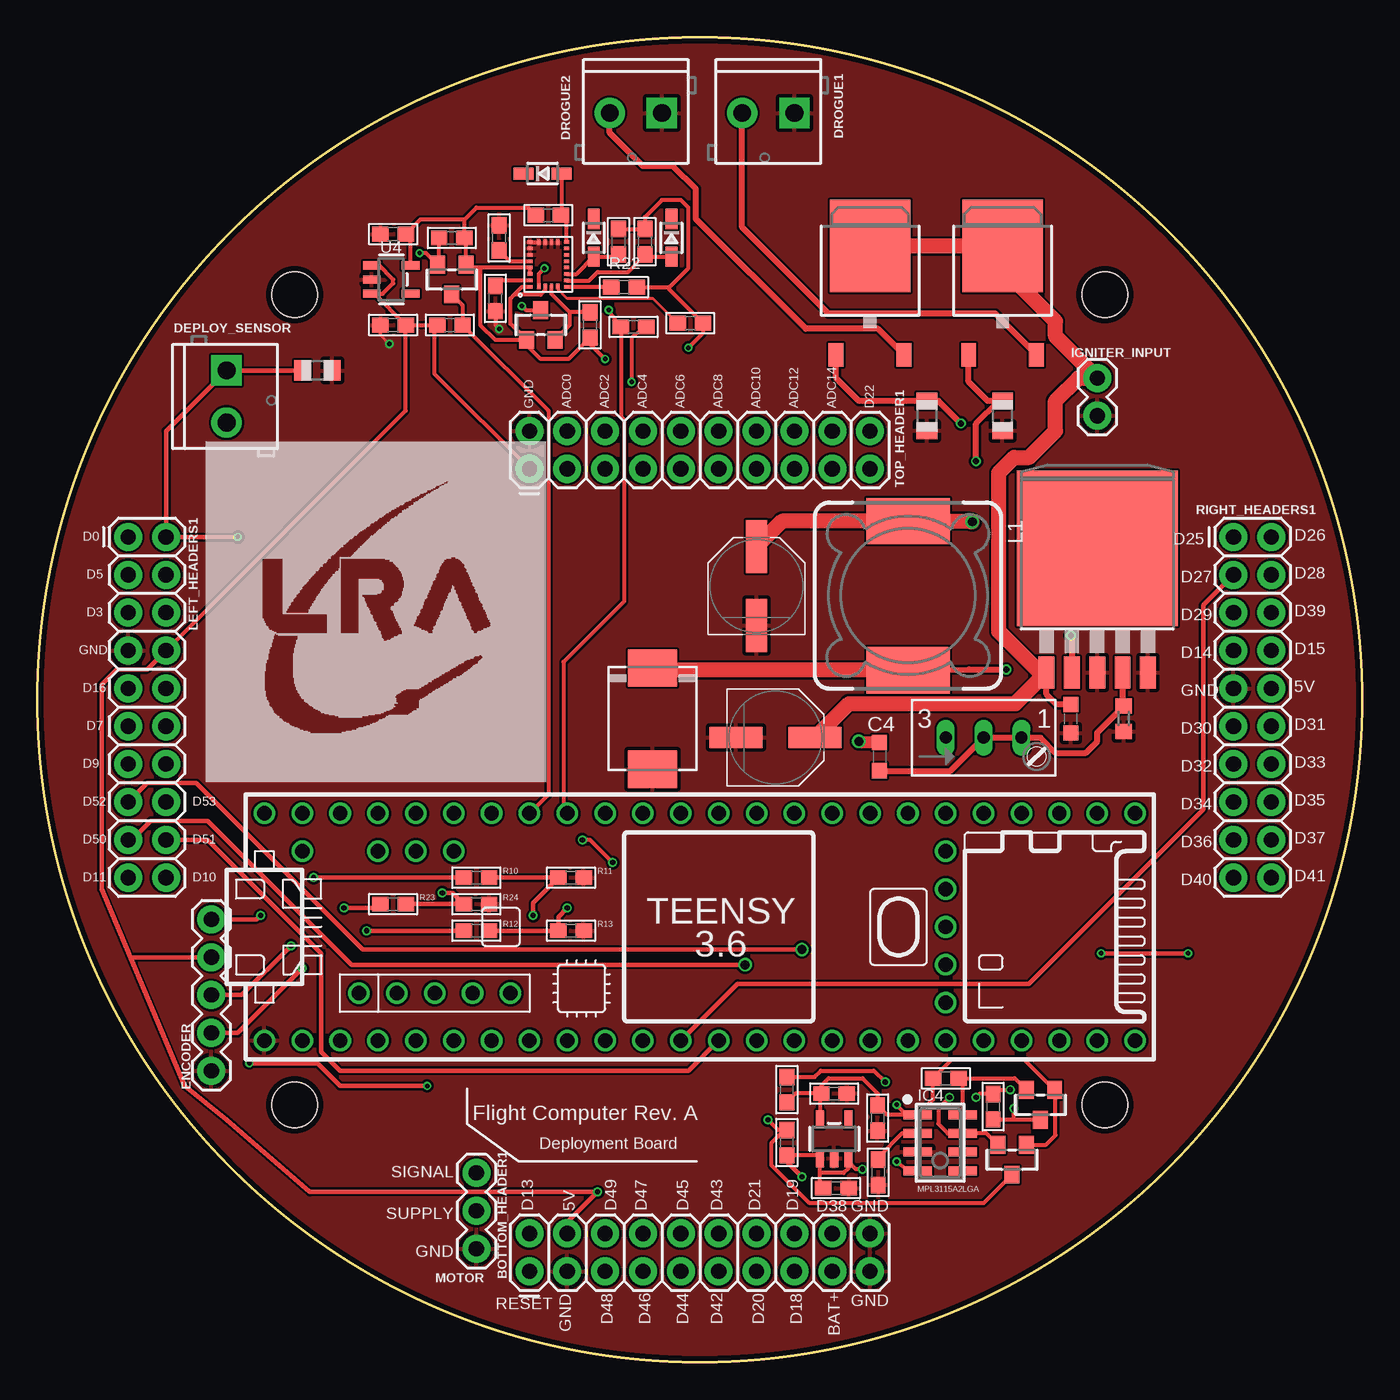
[diagram p2: board, top side]
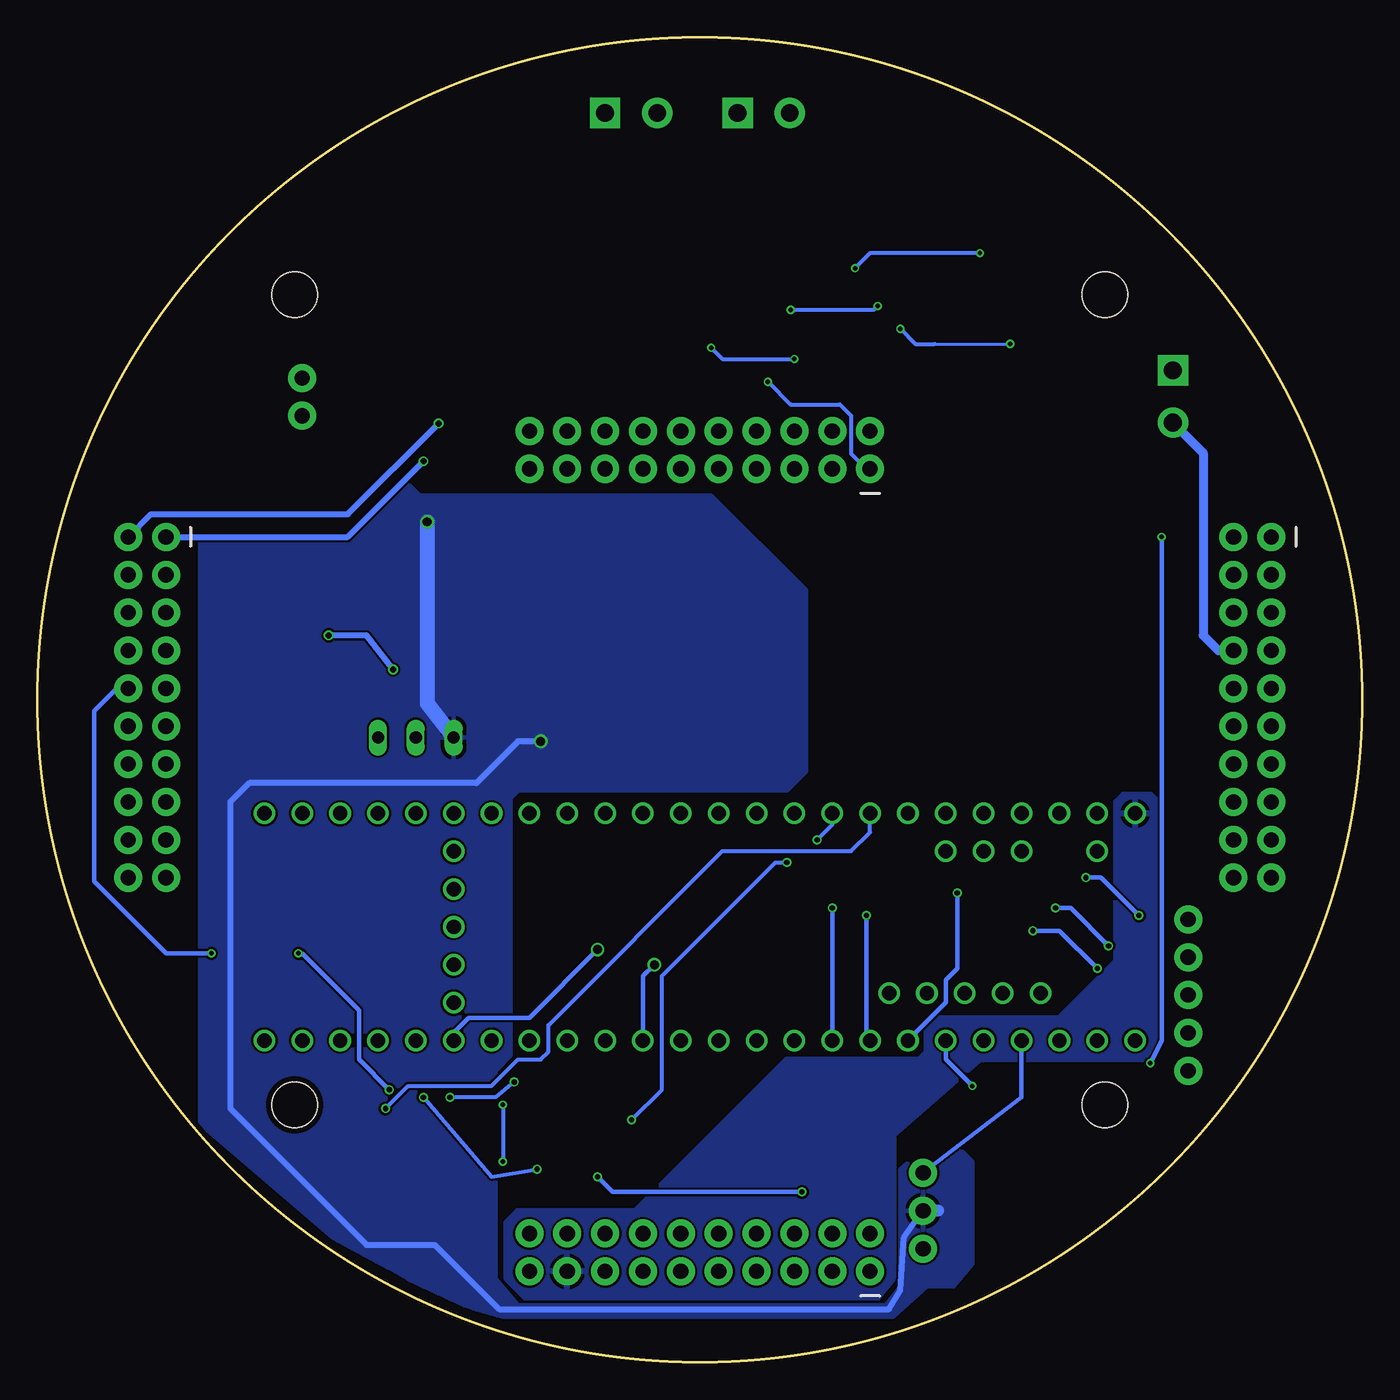
[diagram p3: board, bottom side, seen from below]

Size 88.9 x 88.9 mm. Coordinates in mm from the lower left corner, seen from the top.
Outline: circle at 44.45,44.45 radius 44.45
Copper layers (1*16): Top 0.035559375mm / dielectric 1.6mm / Bottom 0.035559375mm
Design rules "oshpark-2layer": minimum track width 6mil, minimum drill 10mil, track to track 6mil, track to pad 6mil, pad to pad 6mil, via to via 6mil, smd to smd 6mil, copper to edge 15mil, drill to drill 6mil, minimum pad ring 5mil, minimum via ring 5mil, stop-mask expansion 2.5mil, vias tented up to drill 0mil, thermal gap 10mil
Holes 3.05 mm at 17.27,17.27 71.63,17.27 17.27,71.63 71.63,71.63

### Footprints (pad centres in the part's own frame; a part is rotated, then mirrored left to right if it is on the bottom)
2X10 = drill 1.016 pad 1.88: 1 0,0; 2 0,2.54; 3 2.54,0; 4 2.54,2.54; 5 5.08,0; 6 5.08,2.54; 7 7.62,0; 8 7.62,2.54; 9 10.16,0; 10 10.16,2.54; 11 12.7,0; 12 12.7,2.54; 13 15.24,0; 14 15.24,2.54; 15 17.78,0; 16 17.78,2.54; 17 20.32,0; 18 20.32,2.54; 19 22.86,0; 20 22.86,2.54
PANASONIC_D = smd 3.556 x 1.4: + 2.654,0; - -2.654,0
0603 = smd 1.016 x 1.016: 1 -0.953,0; 2 0.953,0
0603' = smd 1.1 x 1: 1 -0.85,0; 2 0.85,0
DO214AB = smd 2.5 x 3.3: A 3.4,0; C -3.4,0
SOD-323 = smd 1.35 x 0.8: A 1.27,0; C -1.27,0
SCREWTERMINAL-3.5MM-2 = drill 1.2 pad 2.032 square: 1 0,0 | drill 1.2 pad 2.032: 2 3.5,0
1X05 = drill 1.016 pad 1.88: 1 0,0; 2 2.54,0; 3 5.08,0; 4 7.62,0; 5 10.16,0
TO263-5 = smd 1.067 x 2.159: 1 -3.404,-5.791; 2 -1.702,-5.791; 3 0,-5.791; 4 1.702,-5.791; 5 3.404,-5.791 | smd 10.8 x 10.41: 6 0,2.54
LGA24_3.5X3.1MM = smd 0.23 x 0.35: 1 -1.505,1.22; 6 -1.505,-1.22; 7 -1.075,-1.22; 8 -0.645,-1.22; 9 -0.215,-1.22; 10 0.215,-1.22; 11 0.645,-1.22; 12 1.075,-1.22; 13 1.505,-1.22; 18 1.505,1.22; 19 1.075,1.22; 20 0.645,1.22; 21 0.215,1.22; 22 -0.215,1.22; 23 -0.645,1.22; 24 -1.075,1.22 | smd 0.35 x 0.23: 2 -1.475,0.645; 3 -1.475,0.215; 4 -1.475,-0.215; 5 -1.475,-0.645; 14 1.475,-0.645; 15 1.475,-0.215; 16 1.475,0.215; 17 1.475,0.645
LGA8 = smd 1.9 x 0.6: P$1 -1.5,1.875; P$2 -1.5,0.625; P$3 -1.5,-0.625; P$4 -1.5,-1.875; P$5 1.5,-1.875; P$6 1.5,-0.625; P$7 1.5,0.625; P$8 1.5,1.875
1X02 = drill 1.016 pad 1.88: 1 0,0; 2 2.54,0
SRR1280 = smd 5.6 x 3.1: 1 0.635,5; 2 0.635,-5
1X03 = drill 1.016 pad 1.88: 1 0,0; 2 2.54,0; 3 5.08,0
SOT23-WIDE = smd 1 x 1.2: 1 -0.95,-1; 2 0.95,-1; 3 0,1
R0805 = smd 1.1 x 1.4: 1 -1,0; 2 1,0
S64W = drill 0.813 long: A 2.54,1.27; E -2.54,1.27; S 0,1.27
R0603 = smd 1 x 1.1: 1 -0.85,0; 2 0.85,0
TO252 = smd 5.4 x 6.2: D 0,1.23 | smd 1 x 1.6: G -2.28,-6.07; S 2.28,-6.07
SOT23-5 = smd 0.55 x 1.2: 1 -0.95,-1.3; 2 0,-1.3; 3 0.95,-1.3; 4 0.95,1.3; 5 -0.95,1.3
TEENSY_3.5/3.6 = drill 0.965: 0/RX -25.4,-7.62; 1/TX -22.86,-7.62; 2 -20.32,-7.62; 3/CANTX -17.78,-7.62; 3V3 7.62,-7.62; 3V3_2 17.78,-2.54; 3V3_LO -22.86,7.62; 4/CANRX -15.24,-7.62; 5 -12.7,-7.62; 6 -10.16,-7.62; 7 -7.62,-7.62; 8 -5.08,-7.62; 9/CS -2.54,-7.62; 10/CS 0,-7.62; 11/MOSI 2.54,-7.62; 12/MISO 5.08,-7.62; 13/SCK 5.08,7.62; 14/A0 2.54,7.62; 15/A1 0,7.62; 16/A2 -2.54,7.62; 17/A3 -5.08,7.62; 18/A4/SDA -7.62,7.62; 19/A5/SCL -10.16,7.62; 20/A6 -12.7,7.62; 21/A7 -15.24,7.62; 21/DAC0 12.7,7.62; 22/A8 -17.78,7.62; 23/A9 -20.32,7.62; 24 10.16,-7.62; 25 12.7,-7.62; 26 15.24,-7.62; 27 17.78,-7.62; 28 20.32,-7.62; 29 22.86,-7.62; 30 25.4,-7.62; 31/A12 27.94,-7.62; 32/A13 30.48,-7.62; 33/A14 30.48,7.62; 34/A15 27.94,7.62; 35/A16 25.4,7.62; 36/A17 22.86,7.62; 37/A18 20.32,7.62; 38/A19 17.78,7.62; 39/A20 15.24,7.62; A10 -17.78,5.08; A11 -15.24,5.08; A22/DAC1 10.16,7.62; AGND -25.4,7.62; AREF -20.32,5.08; GND -27.94,-7.62; GND2 7.62,7.62; GND3 17.78,0; PROG 17.78,2.54; RESET 17.78,5.08; U5V -21.59,-4.445; UD+ -16.51,-4.445; UD- -19.05,-4.445; UGND1 -13.97,-4.445; UGND2 -11.43,-4.445; VBAT 17.78,-5.08; VIN -27.94,7.62; VUSB -25.4,5.08

### Placement (x,y rotation side)
BOTTOM_HEADER1  33.02,6.1 0 top
C1  49.53,41.91 0 top
C2  48.26,52.07 90 top
C3  69.34,43.18 90 top
C4  56.52,40.64 270 top
C9  10µF  [0603']  23.88,69.6 180 top
C10  10µF  [0603']  23.88,75.69 180 top
C11  0.22uF  [0603']  30.73,71.37 270 top
C12  10uF  [0603']  30.99,75.44 90 top
C13  0.1µF  [0603']  56.42,12.75 270 top
C14  0.1µF  [0603']  53.47,18.03 0 top
C15  10uF  [0603']  53.59,11.68 0 top
C16  10uF  [0603']  56.39,16.38 270 top
D1  41.27,43.18 270 top
D5  37.34,75.44 270 top
D6  42.55,75.44 270 top
D7  33.91,79.76 0 top
DEPLOY_SENSOR  12.7,66.55 270 top
DROGUE1  50.8,83.82 180 top
DROGUE2  41.91,83.82 180 top
ENCODER  11.68,19.56 90 top
IC1  71.12,52.07 0 top
IC3  34.29,73.66 90 top
IC4  60.58,14.73 0 top
IGNITER_INPUT  71.12,63.5 90 top
L1  59.05,51.44 180 top
LEFT_HEADERS1  6.1,55.37 270 top
MOTOR  29.46,7.62 90 top
Q3  33.78,69.6 0 top
Q4  27.81,72.64 180 top
Q5  67.31,17.27 180 top
Q6  65.41,13.59 180 top
R1  64.77,63.5 90 top
R2  59.69,63.5 90 top
R3  63.5,40.64 0 top
R4  72.9,43.18 90 top
R5  10K  [0603']  50.29,18.29 90 top
R6  10K  [0603']  50.29,14.73 90 top
R7  10K  [0603']  64.14,17.14 90 top
R8  10K  [0603']  60.96,19.05 180 top
R9  18.8,66.55 180 top
R10  10K  [0603']  29.46,32.51 0 top
R11  20K  [0603']  35.81,32.51 0 top
R12  10K  [0603']  29.46,28.96 0 top
R13  20K  [0603']  35.81,28.96 0 top
R14  10K  [0603']  27.81,75.44 0 top
R15  10K  [0603']  37.08,69.6 270 top
R16  10K  [0603']  40.01,69.47 0 top
R17  10K  [0603']  27.69,69.6 180 top
R18  10K  [0603']  34.29,76.96 180 top
R19  10K  [0603']  40.77,75.18 270 top
R20  10K  [0603']  38.99,75.18 270 top
R21  10K  [0603']  43.81,69.72 180 top
R22  10K  [0603']  39.37,72.14 180 top
R23  10K  [0603']  23.88,30.73 0 top
R24  20K  [0603']  29.46,30.73 0 top
RIGHT_HEADERS1  80.26,55.37 270 top
TOP_HEADER1  33.02,59.94 0 top
U1  64.77,73.66 0 top
U2  55.88,73.66 0 top
U4  23.75,72.64 270 top
U5  53.47,14.99 0 top
U$1  43.18,29.21 0 top

### Tracks (layer width: path | path; a pad name or v marks a point on that pad's centre or on a via)
5.0V  (via drill 0.3, 0.35)
  Top 0.254: C15.1 52.52,12.16 52.52,12.7 | 52.52,12.7 U5.1 52.32,13.88 R6.1 | U5.3 54.42,13.46 | 54.42,13.46 54.42,13.02 54.1,12.7 52.52,12.7 | v62.99,17.78 63.21,18 R7.2 64.43,18.29 v65.28,18.29 | v55.37,12.95 54.92,12.95 54.42,13.46 | U4.1 22.93,73.59 23.88,72.64 23.88,72.39 23.18,71.69 U4.3 22.63,71.69 C9.1 | C9.1 26.67,69.6 | 26.67,69.6 R17.2 | LEFT_HEADERS1.8 24.73,63.84 C9.1 | TOP_HEADER1.1 26.67,66.29 26.67,69.6 | R16.2 39.88,68.75 v39.88,65.79
  Top 0.305: R6.1 50.29,13.46 v51.31,12.45 | BOTTOM_HEADER1.4 35.56,9.4 v37.59,11.43 18.29,11.43 12.7,16.26 9.91,18.54 6.27,27.14 | 6.27,27.14 4.32,31.75 4.32,45.47 5.33,46.48 7.37,46.48 LEFT_HEADERS1.8 | v71.37,27.43 v77.22,27.43 | ENCODER.4 6.3,27.18 6.27,27.14
  Bottom 0.203: 71.12,27.43 v71.37,27.43
  Bottom 0.254: v62.99,17.78 58.42,12.45 v55.37,12.95 | v39.88,65.79 38.35,64.26 35.05,64.26 34.29,63.5 34.29,60.96 33.27,59.94 TOP_HEADER1.1
  Bottom 0.305: v51.31,12.45 50.29,11.43 v37.59,11.43 | v65.28,18.29 67.31,20.32 67.31,23.62 71.12,27.43 | RIGHT_HEADERS1.10 83.57,45.21 85.09,43.69 85.09,32.26 80.26,27.43 v77.22,27.43
  Bottom 0.61: DEPLOY_SENSOR.2 10.67,61.02 10.67,48.77 9.65,47.75 LEFT_HEADERS1.8
+3V3  (via drill 0.3)
  Top 0.254: Q6.1 67.67,14.59 68.33,15.24 68.33,18.21 Q5.1 66.21,20.32 61.38,20.32 R8.2 60.11,17.64 IC4.P$1 | C14.1 52.52,17.93 U5.5 | C14.1 50.88,18.03 R5.1 | C14.1 52.62,18.58 53.09,19.05 55.37,19.05 56.39,18.03 C16.1 57.01,16.61 IC4.P$1 | IC4.P$1 58.32,16.61 v57.66,17.27 | v57.66,13.46 58.52,12.86 IC4.P$4
  Bottom 0.254: v57.66,17.27 v57.66,13.46
A_CHANNEL  (via drill 0.35)
  Top 0.305: ENCODER.3 13.72,24.64 v17.02,27.94 | v20.57,30.48 22.77,30.48 R23.1
  Bottom 0.305: v17.02,27.94 19.56,30.48 v20.57,30.48
A_CHANNEL_3V3  (via drill 0.35)
  Top 0.305: R23.2 R24.1 27.85,31.5 v27.18,31.5
  Bottom 0.305: v27.18,31.5 27.18,26.42 27.94,25.65 27.94,24.13 U$1.5
B_CHANNEL  (via drill 0.35)
  Top 0.305: ENCODER.5 14.73,29.72 v14.99,29.97 | v18.54,32.51 R10.1
  Bottom 0.305: v14.99,29.97 17.53,32.51 v18.54,32.51
B_CHANNEL_3V3  (via drill 0.35)
  Top 0.305: R10.2 R11.1 33.27,30.82 v33.27,29.97
  Bottom 0.305: v33.27,29.97 33.27,21.84 U$1.6
BATT_IN
  pour Bottom: 56.13,4.32 57.4,5.59 57.4,9.4 56.64,10.16 48.77,10.16 38.61,20.32 29.72,20.32 29.21,20.83 29.21,22.61 28.7,23.11 20.32,23.11 16.51,26.92 16.51,37.59 16,38.1 14.22,38.1 13.72,37.59 13.72,20.32 25.65,20.32 31.5,15.24 31.5,5.59 32.51,4.32
C2
  Top 0.254: IC3.24 31.09,72.58 C11.1
CAP1
  Top 0.254: C12.1 31.7,73.88 IC3.21
CAP2
  Top 0.254: IC4.P$2 58.03,15.36 56.42,13.75 C13.1
CS_A/G
  Top 0.254: R19.2 40.79,74.31 | 40.79,74.31 40.93,74.17 D6.A | IC3.7 37.02,72.58 37.59,73.15 39.62,73.15 40.79,74.31
CS_M
  Top 0.254: IC3.8 36.19,73.02 D5.A 38.82,74.17 R20.2
D4  (via drill 0.3)
  Top 0.305: R9.2 DEPLOY_SENSOR.1 8.64,62.48 LEFT_HEADERS1.2 v13.46,55.37 | v14.22,20.07 18.8,20.07 20.32,18.54 v26.16,18.54
  Bottom 0.305: v13.46,55.37 13.46,21.59 v14.22,20.07 | v26.16,18.54 27.94,20.32 U$1.4/CANRX
D25  (via drill 0.4)
  Top 0.406: R1.2 64.52,64.5 | 64.52,64.5 63.77,64.5 62.48,65.79 62.49,65.79 U1.G | v62.99,60.45 62.99,62.98 64.52,64.5
  Bottom 0.406: RIGHT_HEADERS1.1 68.07,55.37 v62.99,60.45
D26  (via drill 0.4)
  Top 0.406: U2.G 53.6,66.05 53.59,66.04 55.13,64.5 R2.2 60.47,64.5 v61.98,62.99
  Bottom 0.406: RIGHT_HEADERS1.2 81.28,56.9 68.07,56.9 v61.98,62.99
D27
  Top 0.305: U$1.10/CS 46.99,25.4 66.55,25.4 78.23,37.08 78.23,50.8 RIGHT_HEADERS1.3
D50_MISO  (via drill 0.6)
  Top 0.305: v47.5,26.67 21.08,26.67 11.43,36.32 7.62,36.32 6.35,35.05 LEFT_HEADERS1.17
  Bottom 0.305: U$1.12/MISO 48.26,25.91 v47.5,26.67
D51_MOSI
  Top 0.305: U$1.11/MOSI 43.69,19.56 20.32,19.56 19.05,20.83 19.05,27.43 11.43,35.05 LEFT_HEADERS1.18
D52_SCK  (via drill 0.6)
  Top 0.305: LEFT_HEADERS1.15 7.37,38.86 10.67,38.86 21.84,27.69 v51.31,27.69
  Bottom 0.305: v51.31,27.69 55.88,23.11 59.94,23.11 60.96,22.1 U$1.27
DEN_3V
  Top 0.254: IC3.13 35.51,76.59 R18.1 35.18,77 D7.A
GND  (via drill 0.3)
  Top 0.203: v23.62,68.33 23.03,68.92 C9.2
  Top 0.254: IC3.18 33.62,75.17 IC3.17 | C11.2 30.73,69.6 v30.99,69.34
  Bottom 0.203: 28.7,68.33 v23.62,68.33
  Bottom 0.254: v30.99,69.34 29.97,68.33 28.7,68.33
  pour Top: 44.45,0 arc90 88.9,44.45 arc90 44.45,88.9 arc90 0,44.45 arc90
IGNITER_BATT
  Top 0.406: C3.2 68.39,44.13 67.72,44.81 IC1.1
  Top 1.016: U2.D U1.D 64.77,73.41 68.33,69.85 68.33,68.83 IGNITER_INPUT.2 69.85,66.04 68.33,64.52 68.33,62.48 66.55,60.71 65.53,60.71 64.52,59.69 64.52,49.02 67.26,46.28 IC1.1 65.63,44.2 54.47,44.2 C1.+
MOTOR_SIGNAL
  Bottom 0.305: U$1.2 22.86,17.78 MOTOR.3
N$3  (via drill 0.4)
  Top 0.406: L1.1 62.53,46.48 v65.02,46.48 | v69.34,48.77 69.42,48.69 IC1.2
  Top 1.016: L1.1 41.42,46.44 D1.C
  Bottom 0.406: v65.02,46.48 66.8,48.77 v69.34,48.77
N$4
  Top 0.406: IC1.4 72.82,44.11 R4.2 71.12,42.25 71.12,41.66 70.36,40.89 68.33,40.89 67.31,41.91 R3.A R3.S 61.28,39.69 C4.2
SCL_3.3V
  Top 0.254: IC4.P$8 62.08,18.78 R8.1 65.58,19.05 Q5.2
SCL_3V  (via drill 0.3)
  Top 0.254: R14.1 26.96,73.74 Q4.2 26.09,74.42 v25.65,74.42 | v34.04,73.41 33.65,73.02 IC3.2
  Bottom 0.254: v25.65,74.42 33.02,74.42 v34.04,73.41
SCL_5V  (via drill 0.35)
  Top 0.254: Q5.3 65.53,16.27 | 65.53,16.27 64.16,16.27 R7.1 | 65.53,16.27 v65.53,17.02 | Q4.3 28.54,70.92 R17.1 34.29,63.84 34.29,38.1 U$1.19/A5/SCL
  Bottom 0.254: v65.53,17.02 64.01,18.54 58.42,18.54 56.64,20.32 55.12,20.32 54.61,20.83 54.61,22.61 42.93,34.29 34.29,34.29 33.02,35.56 U$1.19/A5/SCL
SDA_3.3V  (via drill 0.35)
  Top 0.254: R5.2 52.16,19.14 52.58,19.56 56.13,19.56 v56.9,18.8 | v61.21,17.78 60.45,17.02 60.45,16 61.1,15.36 IC4.P$7 63.69,15.36 Q6.2
  Bottom 0.254: v56.9,18.8 58.17,17.78 v61.21,17.78
SDA_3V
  Top 0.254: R15.1 35.73,70.45 | IC3.4 34.51,71.67 35.73,70.45 | 35.73,70.45 35.73,69.59 Q3.2
SDA_5V  (via drill 0.3, 0.35)
  Top 0.254: Q6.3 63.48,10.67 51.82,10.67 49.28,13.21 49.28,14.73 50.13,15.58 R6.2 49.7,15.58 v49.02,16.26 | v38.61,33.53 37.08,35.05 v36.58,35.05 | v38.35,70.61 38.35,70.52 R16.1 39.16,63.46 39.37,63.25 39.37,51.05 35.31,46.99 35.31,37.08 U$1.18/A4/SDA | v32.51,70.87 32.78,70.6 Q3.3
  Bottom 0.254: v49.02,16.26 46.99,18.29 46.99,25.91 39.37,33.53 v38.61,33.53 | v36.58,35.05 35.56,36.07 U$1.18/A4/SDA | v38.35,70.61 32.77,70.61 v32.51,70.87
SDO_AG
  Top 0.203: R21.2 41.31,71.37 35.56,71.37 34.94,72 IC3.5
SDO_M
  Top 0.254: IC3.6 38.5,72.16 R22.2
SOURCE
  Top 0.406: U1.S 64.28,70.36 53.09,70.36 47.3,76.14 DROGUE1.2
SOURCE1
  Top 0.406: U2.S 56.41,69.34 51.56,69.34 44.2,76.71 44.2,78.74 42.67,80.26 40.64,80.26 38.41,82.49 DROGUE2.2
SW_MODE_SUPPLY  (via drill 0.6)
  Top 0.813: C4.1 55.18,41.59 v55.12,41.66
  Top 1.016: v62.74,56.39 62.44,56.44 L1.2 49.97,56.44 C2.+
  Bottom 0.406: v55.12,41.66 56.64,41.66 59.44,38.86 74.68,38.86 75.95,37.59 75.95,17.02 66.8,7.87 62.23,7.87 57.91,3.56 31.75,3.56 30.99,4.83 30.73,8.38 MOTOR.2
  Bottom 0.813: 28.45,10.16 MOTOR.2
  Bottom 1.016: v62.74,56.39 62.74,44.2 R3.E
  pour Bottom: 26.16,6.6 26.16,13.46 27.43,14.73 28.96,14.73 30.99,12.95 30.99,5.08 32,3.81 56.64,3.81 58.17,5.59 58.17,19.56 57.15,20.57 57.15,37.85 56.64,38.35 38.61,38.35 37.34,39.62 37.34,51.82 43.69,58.17 63.25,58.17 65.28,60.2 76.71,60.2 77.98,58.93 77.98,16 69.09,8.38 65.28,6.35 64.01,5.59 60.71,4.06 60.2,3.81 59.44,3.56 57.66,3.05 31.5,3.05 29.21,5.08 27.43,5.08
VDD  (via drill 0.3)
  Top 0.254: 29.72,73.44 IC3.22 IC3.23 | 29.72,73.44 28.96,73.44 Q4.1 28.76,75.34 R14.2 28.66,76.67 | 28.66,76.67 29.46,77.47 32.93,77.47 R18.2 | R20.1 R19.1 40.77,76.83 41.91,77.98 43.18,77.98 43.69,77.47 43.69,73.41 42.42,72.14 | R22.1 42.42,72.14 | R21.1 42.42,71.97 42.42,72.14 | R15.2 35.65,67.31 33.78,67.31 32.83,68.26 Q3.1 | R15.2 37.5,68.33 | 44.66,69.3 R21.1 | Q3.1 31.75,69.68 31.75,71.37 32,71.63 | 32,71.63 32.53,72.16 IC3.1 | IC3.3 34.08,71.92 33.78,71.63 32,71.63 | 29.72,73.44 29.72,69.6 30.72,68.6 Q3.1 | 28.66,76.67 25.7,76.67 24.81,75.78 | 24.81,75.78 C10.1 | R21.1 44.66,69.05 v43.69,68.07 | v38.1,67.31 37.08,68.33 R15.2 | U4.5 25.05,75.53 24.81,75.78
  Bottom 0.254: v43.69,68.07 42.93,67.31 v38.1,67.31
X_CHANNEL  (via drill 0.35)
  Top 0.305: ENCODER.2 13.46,22.1 v17.78,26.42 | v22.1,28.96 R12.1
  Bottom 0.305: v17.78,26.42 20.32,28.96 v22.1,28.96
X_CHANNEL_3V3  (via drill 0.35)
  Top 0.305: R12.2 R13.1 34.96,29.88 v35.56,30.48
  Bottom 0.305: v35.56,30.48 U$1.7

### Text on the board
tPlace: GND | ADC0 | ADC2 | ADC4 | ADC6 | ADC8 | ADC10 | ADC12 | ADC14 | D22 | D0 | D25 | D26 | D5 | D28 | D27 | D3 | D29 | D39 | GND | D14 | D15 | D16 | GND | 5V | D7 | D30 | D31 | D9 | D32 | D33 | D52 | D53 | D34 | D35 | D50 | D51 | D36 | D37 | D11 | D10 | D40 | D41 | Flight Computer Rev. A | Deployment Board | SIGNAL | D38 | GND | SUPPLY | D13 | 5V | D49 | D47 | D45 | D43 | D21 | D19 | GND | GND | RESET | D48 | D46 | D44 | D42 | D20 | D18 | GND | BAT+